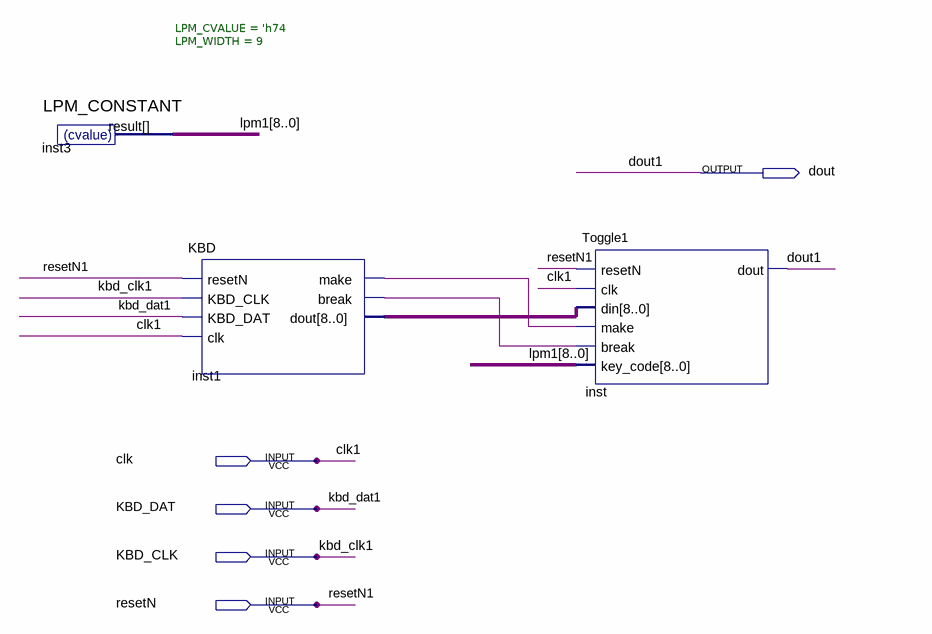
[diagram p0: schematic sheet]
// Quartus schematic 6-press.bdf as structural Verilog: 3 symbols, 5 pins
module \6-press  (
  input  clk,
  input  KBD_DAT,
  input  KBD_CLK,
  input  resetN,
  output dout
);

  wire inst1_break, inst1_make;
  wire [8:0] inst1_dout, lpm1;

  LPM_CONSTANT #(.LPM_CVALUE('h74), .LPM_WIDTH(9)) inst3 (.result(lpm1));
  KBD inst1 (
    .resetN(resetN), .KBD_CLK(KBD_CLK), .KBD_DAT(KBD_DAT), .clk(clk), .make(inst1_make),
    .\break (inst1_break), .dout(inst1_dout));
  Toggle1 inst (
    .resetN(resetN), .clk(clk), .din(inst1_dout), .make(inst1_make), .\break (inst1_break), .key_code(lpm1),
    .dout(dout));

  // Other names for the same wires on the sheet: clk1 = clk; dout1 = dout; kbd_clk1 = KBD_CLK; kbd_dat1 = KBD_DAT;
  //   resetN1 = resetN
endmodule
